# EAGLE design Grove - Laser PM2.5 Sensor(HM3301) (EAGLE 6.4)
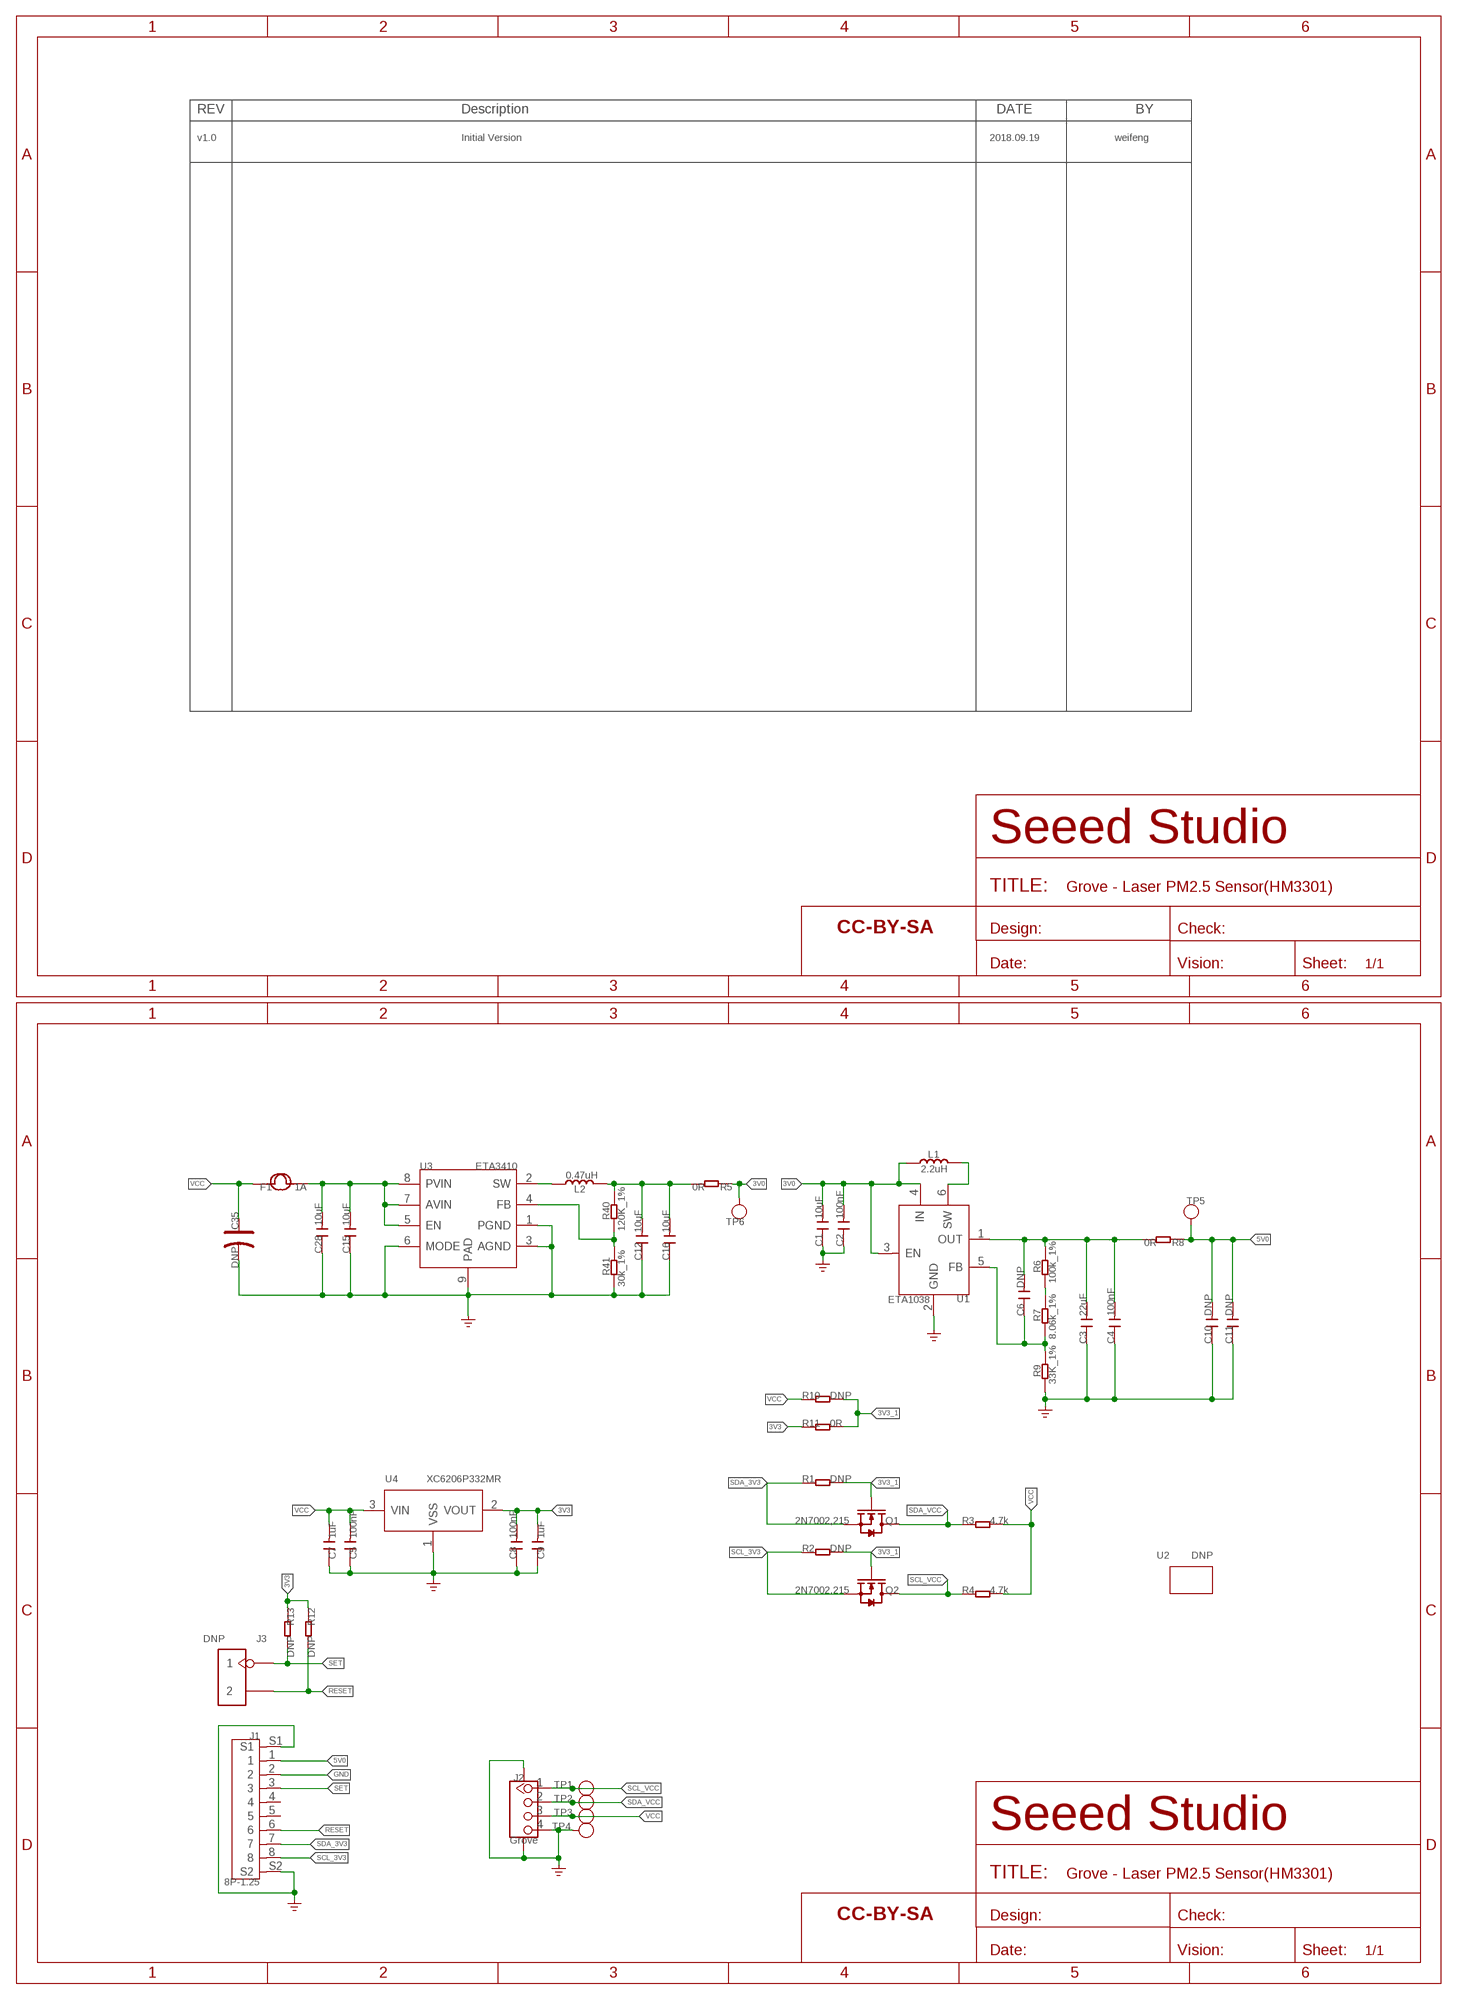
[diagram p0: schematic, sheet 1]

## Parts
C1  10uF  C-0603  [C0603]
C2  100nF  C-0603  [C0603]
C3  22uF  C-0805  [C0805]
C4  100nF  C-0603  [C0603]
C5  100nF  C-0603  [C0603]
C6  DNP  C-0603  [C0603]
C7  1uF  C-0603  [C0603]
C8  100nF  C-0603  [C0603]
C9  1uF  C-0603  [C0603]
C10  DNP  C-0805  [C0805]
C11  DNP  C-0603  [C0603]
C12  10uF  C-0603  [C0603]
C15  10uF  C-0603  [C0603]
C16  10uF  C-0603  [C0603]
C28  10uF  C-0603  [C0603]
C35  DNP  CAP-POLAR-AVX-B  [AVX-B]
F1  1A  FUSE-0805  [F0805]
FR1  SEEEDSTUDIO-OPEN-SCH-FRAME  [SEEEDSTUDIO-PCB-FRAME]
J1  8P-1.25  HEADER-8+2P  [HEADER8+2P-SMD-1.25-15X3.5MM]
J2  Grove  GROVE-CONNECTOR-SMD'90D'  [HW4-SMD-2.0-90D]
J3  DNP  HEADER-2P-65/35MIL  [H2-2.54]
L1  2.2uH  INDUCTOR/FERRITE-BEAD'0806'  [L0806]
L2  0.47uH  L-MPM201610SR33_T  [L201610]
Q1  2N7002,215  MOSFET-N'SOT23'  [SOT-23]
Q2  2N7002,215  MOSFET-N'SOT23'  [SOT-23]
R1  DNP  R-0603  [R0603]
R2  DNP  R-0603  [R0603]
R3  4.7k  R-0603  [R0603]
R4  4.7k  R-0603  [R0603]
R5  0R  R-0603  [R0603]
R6  100k_1%  R-0603  [R0603]
R7  8.06k_1%  R-0603  [R0603]
R8  0R  R-0603  [R0603]
R9  33K_1%  R-0603  [R0603]
R10  DNP  R-0603  [R0603]
R11  0R  R-0603  [R0603]
R12  DNP  R-0603  [R0603]
R13  DNP  R-0603  [R0603]
R40  120K_1%  R-0603  [R0603]
R41  30k_1%  R-0603  [R0603]
TP1  TEST-POINT'4545'  [TP-D45MIL]
TP2  TEST-POINT'4545'  [TP-D45MIL]
TP3  TEST-POINT'4545'  [TP-D45MIL]
TP4  TEST-POINT'4545'  [TP-D45MIL]
TP5  TEST-POINT'4545'  [TP-D45MIL]
TP6  TEST-POINT'4545'  [TP-D45MIL]
U1  ETA1038  CONVERTER-ETA1038  [SOT-23-6]
U2  DNP  GROVE-80X40MM  [GROVE-80X40MM]
U3  ETA3410  CONVERTER-ETA3410  [DFN8G-0.5-2X2MM]
U4  XC6206P332MR  PMIC-XC6206PMR  [SOT-23]
U$4  SEEEDSTUDIO-OPEN-SCH-FRAME  [SEEEDSTUDIO-PCB-FRAME]

## Nets
3V0: C1.2 C2.2 L1.1 R5.1 TP6.T U1.3(EN) U1.4(IN)
3V3: C8.2 C9.2 R11.1 R12.1 R13.1 U4.2(VOUT)
3V3_1: Q1.1(G) Q2.1(G) R1.2 R2.2 R10.2 R11.2
5V0: C10.2 C11.2 J1.1 R8.1 TP5.T
GND: C1.1 C2.1 C3.1 C4.1 C5.1 C7.1 C8.1 C9.1 C10.1 C11.1 C12.1 C15.1 C16.1 C28.1 C35.- J1.2 J1.S1 J1.S2 J2.4 J2.SS1 J2.SS2 R9.2 R41.1 TP4.T U1.2(GND) U3.1(PGND) U3.3(AGND) U3.6(MODE) U3.9(PAD) U4.1(VSS) ; supply symbol labelled GND_POWER
N$7: C15.2 C28.2 F1.2 U3.5(EN) U3.7(AVIN) U3.8(PVIN)
N$8: L1.2 U1.6(SW)
N$9: C3.2 C4.2 C6.2 R6.1 R8.2 U1.1(OUT)
N$10: R6.2 R7.1
N$11: C6.1 R7.2 R9.1 U1.5(FB)
N$21: R40.1 R41.2 U3.4(FB)
N$29: L2.1 U3.2(SW)
N$64: C12.2 C16.2 L2.2 R5.2 R40.2
RESET: J1.6 J3.2 R12.2
SCL_3V3: J1.8 Q2.2(S) R2.1
SCL_VCC: J2.1 Q2.3(D) R4.1 TP1.T
SDA_3V3: J1.7 Q1.2(S) R1.1
SDA_VCC: J2.2 Q1.3(D) R3.1 TP2.T
SET: J1.3 J3.1 R13.2
VCC: C5.2 C7.2 C35.+ F1.1 J2.3 R3.2 R4.2 R10.1 TP3.T U4.3(VIN)
Unconnected: J1.4 J1.5

## Notes on the sheet
- v1.0 | Initial Version | 2018.09.19 | weifeng
- Vout=(R3+R4+R9)/R9x1.17V

## Library data of the parts
C1-C12 C15 C16 C28 = Discrete-small:C*: Ceramic Capacitors
C35 = Discrete-new:CAP-POLAR: Electrolytic Capacitors,Tantalum Capacitors and Super Capacitors
F1 = Discrete-new:FUSE
FR1 U$4 = moudle-new:SEEEDSTUDIO-OPEN-SCH-FRAME
J1 = Connector-new:HEADER-8+2P
J2 = Connector-new:GROVE-CONNECTOR-SMD: 4P-SMD-2.0:320110030;4P-SMD-2.0-90D:320110032
J3 = Connector-new:HEADER-2P
L1 = Discrete-new:INDUCTOR/FERRITE-BEAD
L2 = Discrete-new:L
Q1 Q2 = Discrete-new:MOSFET-N
R1-R13 R40 R41 = Discrete-small:R*
TP1-TP6 = Discrete-new:TEST-POINT; PARTNO: DNP
U1 = IC-new:CONVERTER-ETA1038
U2 = moudle-new:GROVE
U3 = IC-new:CONVERTER-ETA3410: 3MHZ 2A High Step-Down Converter in DFN2x2-8L Package
U4 = IC-new:PMIC-XC6206P: LOW ESR Cap.Compatible Positive Voltage Regulators

## Net classes
3 usbvcc: width 0.203 mm, drill 0.305 mm, clearance 0.203 mm

## Board
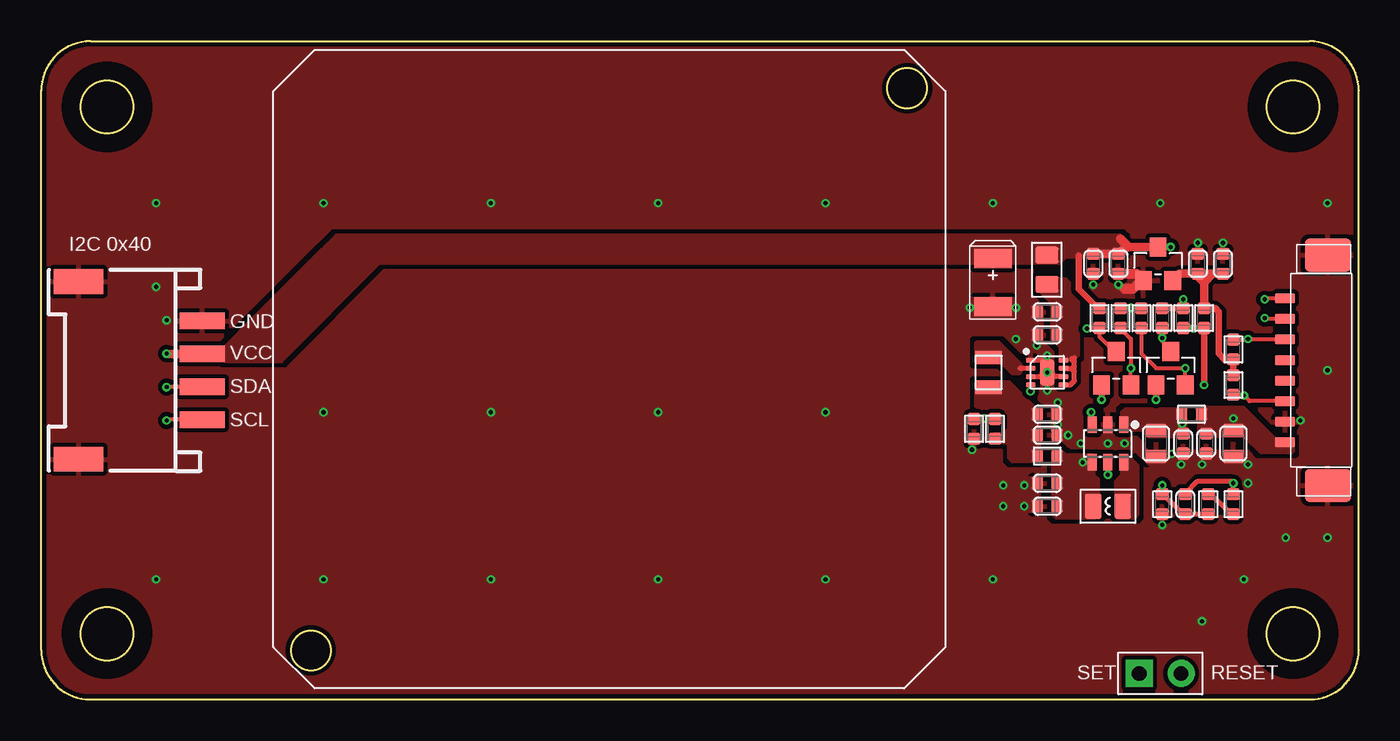
[diagram p1: board, top side]
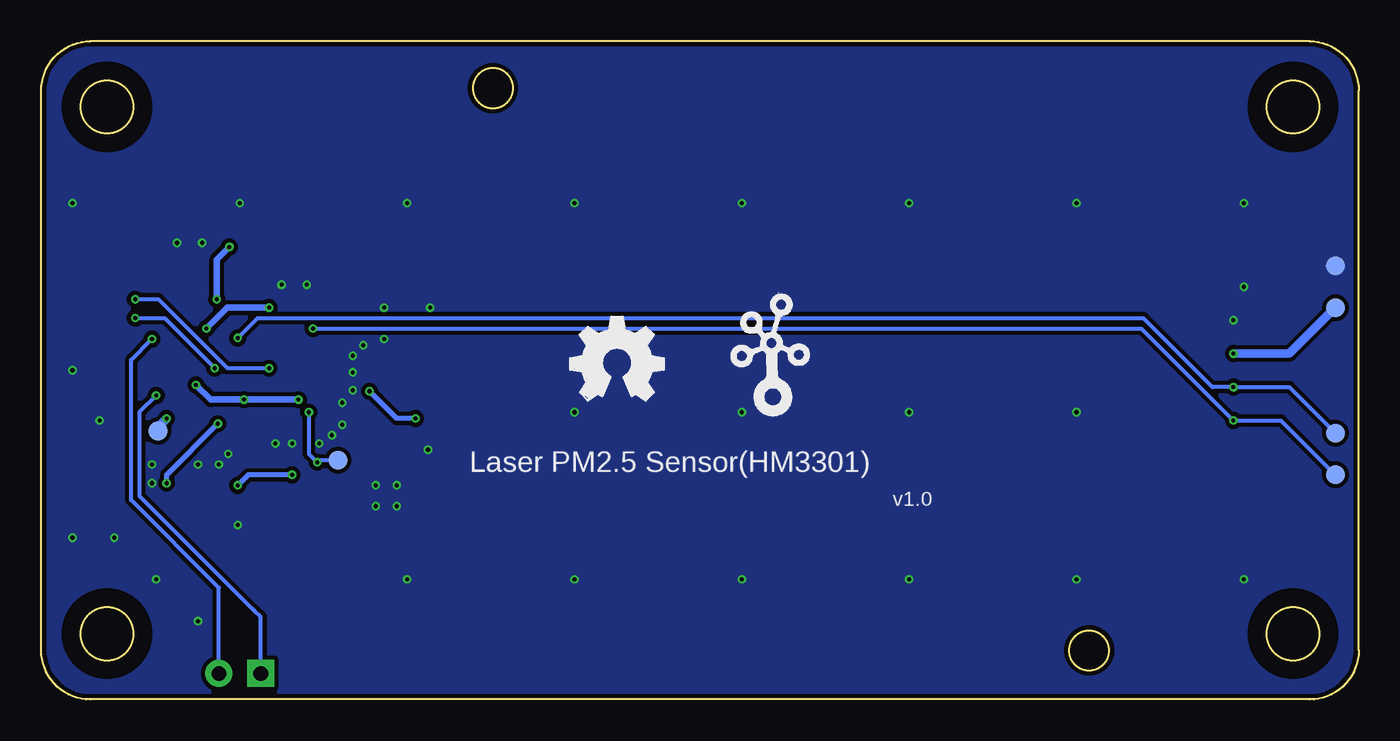
[diagram p2: board, bottom side, seen from below]

Size 80 x 40 mm. Coordinates in mm from the lower left corner, seen from the top.
Outline: circle at 16.38,2.98 radius 1.2
Outline: circle at 52.57,37.14 radius 1.2
Copper layers (1*16): Top 0.035mm / dielectric 1.5mm / Bottom 0.035mm
Design rules "SeeedStudio_2layer_DRU_no_angle_20140221 *": minimum track width 1mil, minimum drill 10mil, track to track 6mil, track to pad 6mil, pad to pad 6mil, via to via 6mil, smd to smd 0mil, copper to edge 10mil, drill to drill 10mil, minimum pad ring 4mil, minimum via ring 4mil, stop-mask expansion 2mil, vias tented up to drill 25mil, thermal gap 10mil

### Footprints (pad centres in the part's own frame; a part is rotated, then mirrored left to right if it is on the bottom)
C0603 = smd 0.762 x 0.696: 1 0,0.602; 2 0,-0.602
C0805 = smd 0.819 x 1.27: 1 -0.79,0; 2 0.79,0
AVX-B = smd 1.143 x 2.286: + 1.46,0; - -1.46,0
F0805 = smd 1.016 x 1.397: 1 -0.889,0; 2 0.889,0
HEADER8+2P-SMD-1.25-15X3.5MM = smd 0.6 x 1.2: 1 -4.375,2.2; 2 -3.125,2.2; 3 -1.875,2.2; 4 -0.625,2.2; 5 0.625,2.2; 6 1.875,2.2; 7 3.125,2.2; 8 4.375,2.2 | smd 2 x 2.8: S1 -7,-0.4; S2 7,-0.4
HW4-SMD-2.0-90D = smd 1.01 x 2.74: 1 -3,-0.1; 2 -1,-0.1; 3 1,-0.1; 4 3,-0.1 | smd 1.5 x 3: SS1 -5.4,7.4; SS2 5.4,7.4
H2-2.54 = drill 0.889 pad 1.651 square: 1 0,1.27 | drill 0.889 pad 1.651: 2 0,-1.27
L0806 = smd 1.016 x 1.524: 1 -0.889,0; 2 0.889,0
L201610 = smd 0.8 x 1.6: 1 -0.9,0; 2 0.9,0
SOT-23 = smd 1.143 x 1.016: 1 1.016,-0.889; 2 1.016,0.889; 3 -1.016,0
R0603 = smd 0.762 x 0.696: 1 0,0.602; 2 0,-0.602
TP-D45MIL = smd 1.143 x 1.143: T 0,0
SOT-23-6 = smd 0.55 x 1.016: 1 -0.95,-1.143; 2 0,-1.143; 3 0.95,-1.143; 4 0.95,1.143; 5 0,1.143; 6 -0.95,1.143
DFN8G-0.5-2X2MM = smd 0.6 x 0.3: 1 -1,0.75; 2 -1,0.25; 3 -1,-0.25; 4 -1,-0.75; 5 1,-0.75; 6 1,-0.25; 7 1,0.25; 8 1,0.75 | smd 0.9 x 1.6: 9 0,0
SOT-23' = smd 1.016 x 1.143: 1 -0.889,-1.016; 2 0.889,-1.016; 3 0,1.016

### Placement (x,y rotation side)
C1  61.08,11.74 90 top
C2  61.08,13.14 90 top
C3  67.69,15.55 90 top
C4  69.34,15.55 180 top
C5  65.4,26.48 180 top
C6  69.46,11.87 180 top
C7  63.88,26.48 180 top
C8  71.75,26.48 0 top
C9  70.23,26.48 0 top
C10  72.38,15.55 90 top
C11  70.73,15.55 180 top
C12  61.08,17.33 270 top
C15  61.08,22.16 90 top
C16  61.08,16.06 270 top
C28  61.08,23.56 90 top
C35  57.78,25.33 90 top
F1  61.06,26.12 270 top
FR1  -5.12,-17.43 0 top  (outside the outline)
J1  77.72,20 90 top
J2  9.67,20 90 top
J3  67.94,1.59 90 top
L1  64.77,11.74 0 top
L2  57.53,19.87 270 top
Q1  68.58,20.13 270 top
Q2  65.27,20.13 270 top
R1  66.8,23.18 180 top
R2  65.53,23.18 180 top
R3  68.07,23.18 180 top
R4  64.26,23.18 180 top
R5  61.08,14.79 270 top
R6  72.38,11.87 0 top
R7  70.86,11.87 0 top
R8  69.84,17.33 270 top
R9  68.07,11.87 0 top
R10  69.34,23.18 0 top
R11  70.61,23.18 0 top
R12  72.38,21.27 180 top
R13  72.38,19.11 0 top
R40  57.91,16.44 0 top
R41  56.64,16.44 180 top
TP1  1.43,13.65 0 bottom
TP2  1.43,16.19 0 bottom
TP3  1.43,23.81 0 bottom
TP4  1.43,26.35 0 bottom
TP5  72.89,16.32 270 bottom
TP6  61.97,14.54 180 bottom
U1  64.77,15.55 180 top
U2  40,20 0 top
U3  61.08,19.87 0 top
U4  XC6206P332MR  [SOT-23']  67.81,26.48 0 top
U$4  -3.72,-9.43 0 top  (outside the outline)
U$5  [OSHW_FILLX200_NOTEXT]  47.88,18.16 0 bottom
U$7  [TWIGLOGO]  35.63,18.18 0 bottom

### Tracks (layer width: path | path; a pad name or v marks a point on that pad's centre or on a via)
3V0  (via drill 0.25 pad 0.51)
  Top 0.254: U1.3 63.81,17.39 v63.75,17.46 | v63.24,14.41 U1.4
  Bottom 0.254: v63.75,17.46 63.75,14.92 v63.24,14.41 63.11,14.54 TP6.T
  pour Top (isolate 0.254, no thermals): 63.62,14.92 62.23,14.92 61.97,15.17 61.46,15.17 61.34,15.05 61.34,11.24 61.59,10.98 64,10.98 64.26,11.24 64.26,13.4 64,13.65 64,14.79 63.88,14.92
3V3
  Top 0.406: R11.1 71.28,23.78 71.5,23.56 71.5,21.02 71.84,20.67 R12.1 R13.1
  Top 0.508: 70.61,25.88 C9.2 69.12,25.88 U4.2 | 70.61,25.88 C8.2 | R11.1 70.61,25.33 | 70.61,25.33 70.61,25.88 | 70.61,25.33 70.1,25.84 | 70.61,25.33 71.11,25.84
3V3_1  (via drill 0.25 pad 0.51)
  Top 0.406: v70.61,19.11 R11.2 70,22.57 v69.97,22.54 69.94,22.57 R10.2 | v67.69,18.22 Q1.1 | v64.38,18.22 Q2.1 | R2.2 65.56,23.81 v66.16,23.81 66.19,23.78 R1.2
  Bottom 0.406: v64.38,18.22 v67.69,18.22 69.72,18.22 v70.61,19.11 | v69.97,22.54 68.7,23.81 v66.16,23.81
5V0  (via drill 0.25 pad 0.51)
  Bottom 0.508: TP5.T 72.89,16.57 v72.38,17.08
  pour Top (isolate 0.254, no thermals): 75.56,14.92 74.04,14.92 73.02,15.94 70.48,15.94 70.23,16.19 70.23,17.59 70.48,17.84 73.02,17.84 74.92,15.94 75.94,15.94 76.07,15.81 76.07,15.05 75.94,14.92
GND  (via drill 0.25 pad 0.51)
  Top 0.305: U3.3 60.83,19.62 U3.9 61.33,19.62 U3.6 | U3.1 60.94,20.62 60.95,20.64
  Top 0.61: 65.78,24.95 66.29,24.95 66.8,25.46 U4.1 66.51,25.88 C5.1
  other vias: 56.38,23.81 59.18,23.81 59.18,21.91 61.08,19.87 61.08,20.89 61.08,18.79 60.45,21.52 61.72,18.03 61.72,16.7 62.35,16.06 64.77,15.55 65.78,15.55 63.11,15.55 68.64,14.92 69.21,14.29 70.48,14.29 73.27,14.29 73.27,13.14 68.07,10.6 63.88,25.21 65.4,25.21 70.23,27.75 71.75,27.75 59.69,11.74 59.69,13.02 58.41,13.02 58.41,11.74 56.51,15.17 76.45,16.95 7.62,23.05 6.98,25.08 6.98,30.16 17.14,30.16 27.3,30.16 37.46,30.16 47.62,30.16 57.78,30.16 67.94,30.16 78.1,30.16 78.1,20 78.1,9.84 75.56,9.84 73.02,7.3 70.48,4.76 57.78,7.3 47.62,7.3 37.46,7.3 6.98,7.3 27.3,7.3 17.14,7.3 17.14,17.46 27.3,17.46 37.46,17.46 47.62,17.46
  pour Top (isolate 0.254, no thermals): 73.4,13.78 67.69,13.78 66.16,15.3 62.35,15.3 61.34,16.32 61.34,18.09 60.7,18.73 60.7,20.89 60.07,21.52 59.18,21.52 58.41,22.29 56.51,22.29 56.13,22.67 56.13,24.19 56.38,24.45 60.19,24.45 60.83,23.81 60.83,21.78 61.46,21.14 61.46,18.98 63.24,17.21 63.24,16.19 63.5,15.94 64.26,15.94 64.51,16.19 64.51,16.95 64.64,17.08 64.89,17.08 65.02,16.95 65.02,16.19 65.27,15.94 66.42,15.94 67.18,15.17 73.27,15.17 73.53,14.92 73.53,13.9
  pour Top (isolate 0.254, no thermals): 60.45,13.52 58.03,13.52 57.78,13.27 57.78,11.62 58.03,11.36 60.45,11.36 60.7,11.62 60.7,13.4 60.57,13.52
  pour Bottom (isolate 0.254, rank 6): -0.64,40.32 80.64,40.32 80.64,-0.32 -0.64,-0.32
  pour Top (isolate 0.254, rank 6): -0.64,40.32 80.64,40.32 80.64,-0.32 -0.64,-0.32
N$7
  Top 0.305: U3.7 62.34,20.12 62.55,20.12 | 62.55,20.12 62.6,20.12 62.73,20.25 | 62.73,20.25 62.73,20.51 | 62.73,20.51 62.73,20.76 | 62.73,20.51 62.54,20.7 | U3.5 62.49,19.12 62.73,19.36 62.73,19.94 | 62.73,19.94 62.73,20.25 | 62.55,20.12 62.73,19.94
  pour Top (isolate 0.254, no thermals): 60.95,25.59 60.57,25.59 60.45,25.46 60.45,24.95 61.34,24.06 61.34,21.91 61.84,21.4 61.84,20.76 61.97,20.64 62.73,20.64 62.99,20.89 62.99,24.19 62.48,24.7 62.48,25.33 62.23,25.59
N$8
  pour Top (isolate 0.254, no thermals): 65.91,14.67 65.65,14.67 65.53,14.54 65.53,13.65 65.15,13.27 65.15,11.24 65.4,10.98 66.42,10.98 66.67,11.24 66.67,14.21 66.21,14.67
N$9  (via drill 0.25 pad 0.51)
  Top 0.305: R6.1 v72.38,13.14 72.26,13.27 70.23,13.27 69.46,12.51 C6.2 | C4.2 69.34,16.7 v69.27,16.76 69.24,16.79 R8.2
  Bottom 0.305: v72.38,13.14 72.38,13.65 v69.27,16.76
  pour Top (isolate 0.254, no thermals): 69.46,17.71 65.78,17.71 65.53,17.46 65.53,16.5 65.71,16.32 66.8,16.32 67.18,15.94 69.46,15.94 69.59,16.06 69.59,17.59
N$10
  Top 0.305: R6.2 72.22,11.27 71.02,12.47 R7.1
N$11  (via drill 0.25 pad 0.51)
  Top 0.305: U1.5 v64.77,13.65 | v68.07,13.02 R9.1 68.1,12.47 69.3,11.27 C6.1 R7.2
  Bottom 0.305: v64.77,13.65 67.43,13.65 v68.07,13.02
N$21  (via drill 0.25 pad 0.51)
  Top 0.305: U3.4 60.08,18.75 v60.07,18.73 | R40.1 57.3,17.05 v57.27,17.08 57.24,17.05 R41.2
  Bottom 0.305: v57.27,17.08 58.41,17.08 v60.07,18.73
N$29
  Top 0.305: U3.2 59.44,20.12 59.43,20.13
  pour Top (isolate 0.254, no thermals): 60.13,20.25 59.69,20.25 58.16,21.78 56.76,21.78 56.64,21.65 56.64,20.51 56.76,20.38 58.29,20.38 58.92,19.75 59.43,19.75 59.69,20 60.13,20 60.19,20.06 60.19,20.19
N$64
  pour Top (isolate 0.254, no thermals): 57.65,19.36 56.76,19.36 56.64,19.24 56.64,17.84 56.89,17.59 58.41,17.59 58.67,17.33 58.67,16.44 58.41,16.19 57.78,16.19 57.65,16.06 57.65,15.68 57.78,15.55 58.54,15.55 58.67,15.43 58.67,14.67 58.92,14.41 60.45,14.41 60.7,14.67 60.7,17.46 59.43,18.73 58.8,19.36
RESET  (via drill 0.25 pad 0.51)
  Top 0.254: R12.2 73.24,21.87 v73.27,21.91 73.3,21.88 J1.6
  Bottom 0.254: J3.2 69.21,6.79 74.54,12.13 74.54,20.64 v73.27,21.91
SCL_3V3  (via drill 0.25 pad 0.51)
  Top 0.254: Q2.2 v66.16,20.13 66.16,21.91 65.53,22.54 R2.1 | J1.8 74.35,24.38 v74.29,24.32
  Bottom 0.254: v66.16,20.13 68.7,20.13 72.89,24.32 v74.29,24.32
SCL_VCC  (via drill 0.25 pad 0.51)
  Top 0.254: J2.1 7.66,17 v7.62,16.95 | Q2.3 65.15,21.14 64.26,22.03 R4.1 63.53,22.57 v63.5,22.54
  Bottom 0.254: TP1.T 4.73,16.95 v7.62,16.95 13.2,22.54 v63.5,22.54
SDA_3V3  (via drill 0.25 pad 0.51)
  Top 0.254: R1.1 66.8,21.02 67.69,20.13 v69.46,20.13 Q1.2 | J1.7 74.34,23.12 v74.29,23.18
  Bottom 0.254: v69.46,20.13 72.51,23.18 v74.29,23.18
SDA_VCC  (via drill 0.25 pad 0.51)
  Top 0.254: J2.2 7.63,19 v7.62,18.98 | R3.1 v68.07,21.97 68.07,21.78 68.58,21.27 Q1.3
  Bottom 0.254: TP2.T 4.22,18.98 v7.62,18.98 8.89,18.98 13.08,23.18 66.86,23.18 v68.07,21.97
SET  (via drill 0.25 pad 0.51)
  Top 0.254: R13.2 72.99,18.51 v73.02,18.48 73.37,18.12 J1.3
  Bottom 0.254: v73.02,18.48 74.04,17.46 74.04,12.38 67.18,5.52 67.05,5.39 66.67,5.01 J3.1
VCC  (via drill 0.25 pad 0.51)
  Top 0.406: R3.2 R10.1 v69.34,24.32 | v68.58,27.49 U4.3 | R4.2 64.16,23.78 62.99,24.95 62.99,26.98
  Top 0.508: J2.3 7.63,21 v7.62,21.02 | U4.3 66.54,27.49 66.03,27.49 | 66.03,27.49 65.81,27.49 C5.2 C7.2 | 66.03,27.49 65.53,28 | 66.29,27.49 65.91,27.49 65.4,26.98
  Bottom 0.406: v69.34,24.32 69.34,26.73 v68.58,27.49
  Bottom 0.508: v7.62,21.02 4.22,21.02 TP3.T
  pour Top (isolate 0.254, no thermals): 65.53,26.86 62.23,26.86 61.84,26.48 20.57,26.48 14.6,20.51 11.17,20.51 11.04,20.64 11.04,21.4 12.95,23.3 16.25,26.6 17.9,28.26 65.53,28.26 65.78,28 65.78,27.11

### Text on the board
tPlace: I2C 0x40 | GND | VCC | SDA | SCL | SET | RESET
bPlace: Laser PM2.5 Sensor(HM3301) | v1.0